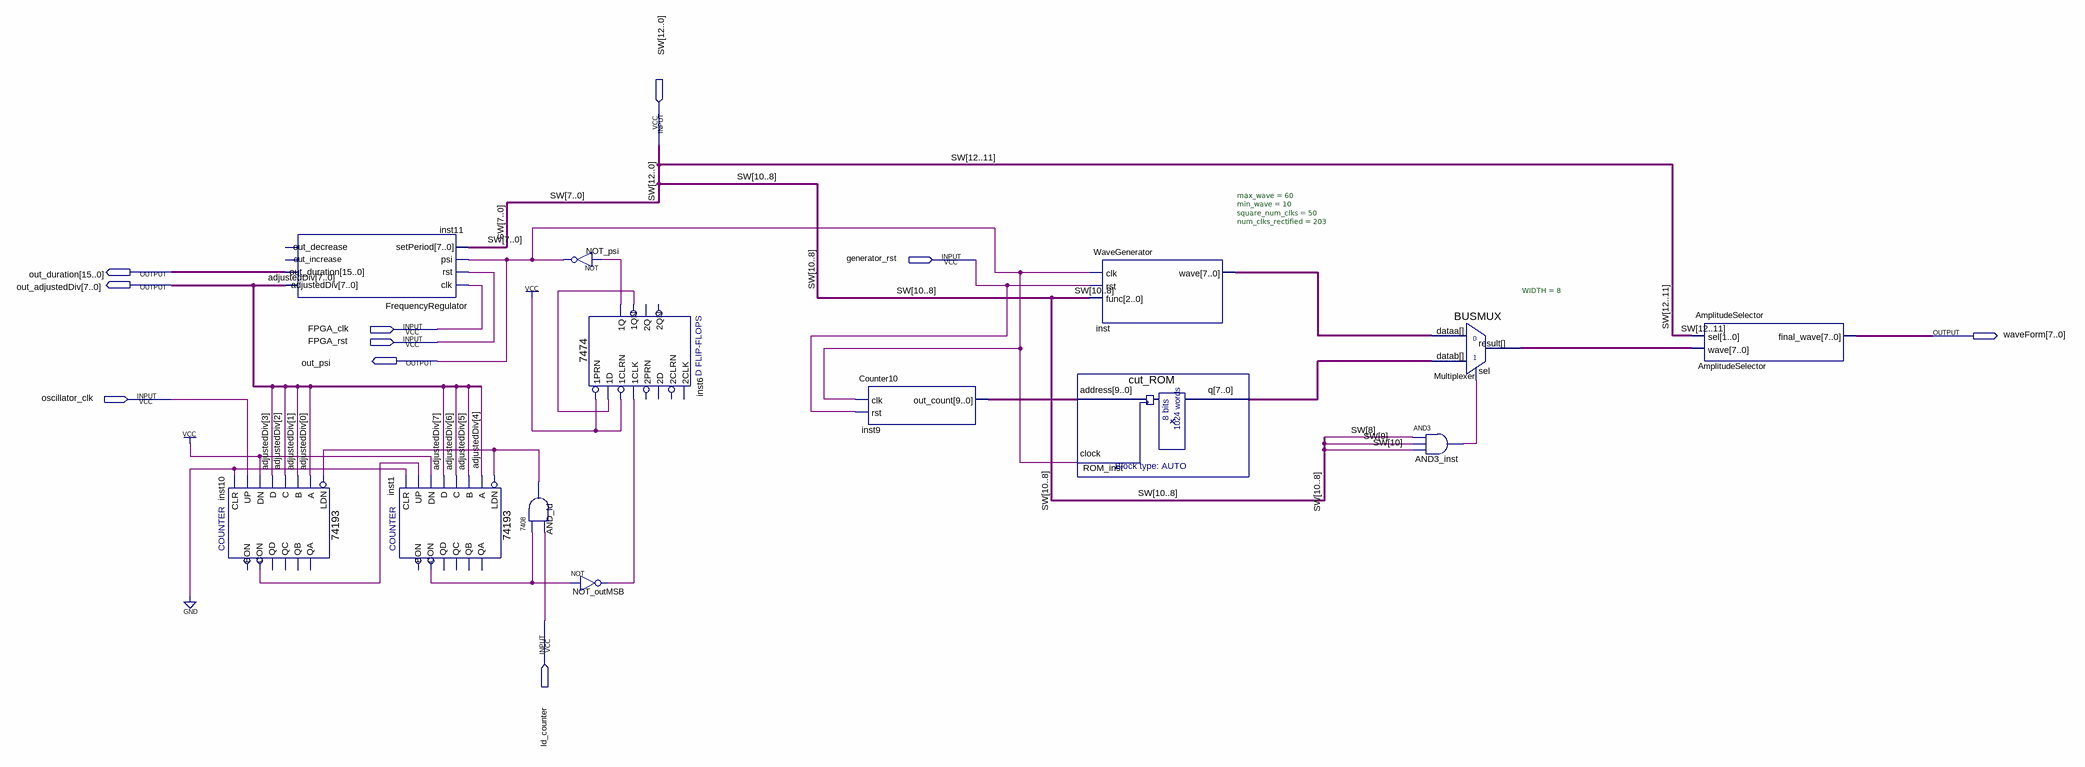
[diagram p0: schematic sheet]
// Quartus schematic waveFromGenerator.bdf as structural Verilog: 13 symbols, 10 pins
module waveFromGenerator (
  input  [12:0] SW,
  input  generator_rst,
  input  FPGA_clk,
  input  FPGA_rst,
  input  oscillator_clk,
  input  ld_counter,
  output [15:0] out_duration,
  output [7:0] out_adjustedDiv,
  output [7:0] waveForm,
  output out_psi
);

  wire AND3_inst_out, AND_ld_1, inst1_con, inst6_1q, inst6_1qn, inst10_con, NOT_outMSB_out;
  wire [7:0] inst_wave, Multiplexer_result, ROM_inst_q;
  wire [9:0] inst9_out_count;

  \74193  inst10 (
    .D(out_adjustedDiv[3]), .C(out_adjustedDiv[2]), .B(out_adjustedDiv[1]), .A(out_adjustedDiv[0]),
    .CLR(1'b0), .UP(oscillator_clk), .DN(1'b1), .LDN(AND_ld_1), .CON(inst10_con));  // open: QB, QA, QD, QC, BON
  FrequencyRegulator inst11 (
    .clk(FPGA_clk), .rst(FPGA_rst), .psi(out_psi), .setPeriod(SW[7:0]), .adjustedDiv(out_adjustedDiv),
    .out_duration(out_duration));  // open: out_increase, out_decrease
  \74193  inst1 (
    .D(out_adjustedDiv[7]), .C(out_adjustedDiv[6]), .B(out_adjustedDiv[5]), .A(out_adjustedDiv[4]),
    .CLR(1'b0), .UP(inst10_con), .DN(1'b1), .LDN(AND_ld_1), .CON(inst1_con));  // open: QB, QA, QD, QC, BON
  \7408  AND_ld (.\3 (ld_counter), .\2 (inst1_con), .\1 (AND_ld_1));
  not NOT_psi (out_psi, inst6_1q);
  \7474  inst6 (
    .\1CLK (NOT_outMSB_out), .\1D (inst6_1qn), .\1PRN (1'b1), .\1CLRN (1'b1), .\1QN (inst6_1qn),
    .\1Q (inst6_1q));  // open: 2D, 2PRN, 2CLK, 2CLRN, 2Q, 2QN
  not NOT_outMSB (NOT_outMSB_out, inst1_con);
  Counter10 inst9 (.clk(out_psi), .rst(generator_rst), .out_count(inst9_out_count));
  cut_ROM ROM_inst (.address(inst9_out_count), .clock(out_psi), .q(ROM_inst_q));
  WaveGenerator #(.max_wave(60), .min_wave(10), .square_num_clks(50), .num_clks_rectified(203)) inst (
    .clk(out_psi), .rst(generator_rst), .func(SW[10:8]), .wave(inst_wave));
  BUSMUX #(.WIDTH(8)) Multiplexer (
    .datab(ROM_inst_q), .sel(AND3_inst_out), .dataa(inst_wave), .result(Multiplexer_result));
  and AND3_inst (AND3_inst_out, SW[8], SW[9], SW[10]);
  AmplitudeSelector AmplitudeSelector (.sel(SW[12:11]), .wave(Multiplexer_result), .final_wave(waveForm));

  // Other names for the same wires on the sheet: adjustedDiv[7:0] = out_adjustedDiv
endmodule
